# EAGLE design electricalily (EAGLE 5.11)
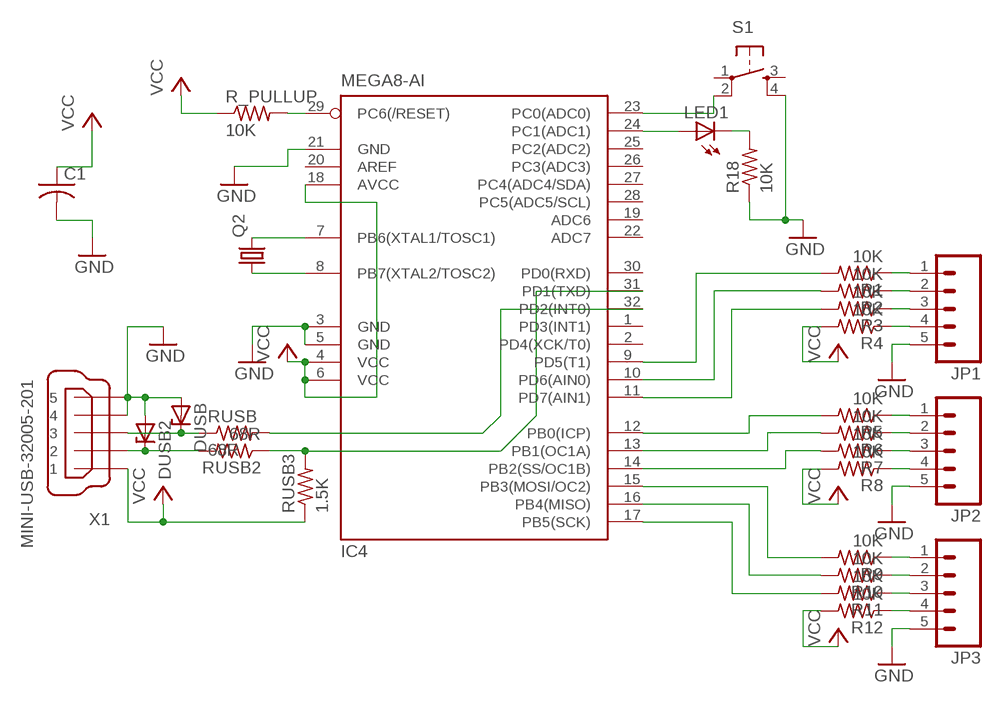
[diagram p0: schematic, sheet 1]

## Parts
C1  C-USC1206K  [C1206K]
DUSB  ZENER-DIODESOD80C  [SOD80C]
DUSB2  ZENER-DIODESOD80C  [SOD80C]
IC4  MEGA8-AI  [TQFP32-08]
JP1  M05LOCK  [1X05_LOCK]
JP2  M05LOCK  [1X05_LOCK]
JP3  M05LOCK  [1X05_LOCK]
LED1  LEDCHIPLED_1206  [CHIPLED_1206]
Q2  CRYSTAL5X3  [CRYSTAL-SMD-5X3]
R1  10K  R-US_M1206  [M1206]
R2  10K  R-US_M1206  [M1206]
R3  10K  R-US_M1206  [M1206]
R4  10K  R-US_M1206  [M1206]
R5  10K  R-US_M1206  [M1206]
R6  10K  R-US_M1206  [M1206]
R7  10K  R-US_M1206  [M1206]
R8  10K  R-US_M1206  [M1206]
R9  10K  R-US_M1206  [M1206]
R10  10K  R-US_M1206  [M1206]
R11  10K  R-US_M1206  [M1206]
R12  10K  R-US_M1206  [M1206]
R18  10K  R-US_M1206  [M1206]
R_PULLUP  10K  R-US_M1206  [M1206]
RUSB  68R  R-US_M1206  [M1206]
RUSB2  68R  R-US_M1206  [M1206]
RUSB3  1.5K  R-US_M1206  [M1206]
S1  6MM_SWITCH6MM_SWITCH  [6MM_SWITCH]
X1  MINI-USB-32005-201  [32005-201]

## Nets
GND: C1.2 DUSB2.A DUSB.A IC4.3(GND) IC4.5(GND) IC4.21(GND) JP1.5 JP2.5 JP3.5 R18.1 S1.4(S1) X1.4 X1.5
N$1: IC4.7(PB6(XTAL1/TOSC1)) Q2.3
N$2: IC4.8(PB7(XTAL2/TOSC2)) Q2.1
N$3: IC4.24(PC1(ADC1)) LED1.A
N$4: IC4.29(PC6(/RESET)) R_PULLUP.2
N$5: IC4.23(PC0(ADC0)) S1.2(P1)
N$6: LED1.C R18.2
N$7: JP1.1 R1.1
N$8: JP1.2 R2.1
N$9: JP1.3 R3.1
N$10: JP1.4 R4.1
N$11: JP2.1 R5.1
N$12: JP2.2 R6.1
N$13: JP2.3 R7.1
N$14: JP2.4 R8.1
N$15: JP3.1 R9.1
N$16: JP3.2 R10.1
N$17: JP3.3 R11.1
N$18: JP3.4 R12.1
N$20: IC4.9(PD5(T1)) R1.2
N$21: IC4.10(PD6(AIN0)) R2.2
N$22: IC4.11(PD7(AIN1)) R3.2
N$23: IC4.12(PB0(ICP)) R5.2
N$24: IC4.13(PB1(OC1A)) R6.2
N$25: IC4.14(PB2(SS/OC1B)) R7.2
N$26: IC4.15(PB3(MOSI/OC2)) R9.2
N$27: IC4.31(PD1(TXD)) RUSB2.1 RUSB3.2
N$28: DUSB2.C RUSB2.2 X1.2
N$29: IC4.16(PB4(MISO)) R10.2
N$30: IC4.17(PB5(SCK)) R11.2
N$32: DUSB.C RUSB.1 X1.3
N$33: IC4.32(PD2(INT0)) RUSB.2
VCC: C1.1 IC4.4(VCC) IC4.6(VCC) IC4.18(AVCC) R4.2 R8.2 R12.2 R_PULLUP.1 RUSB3.1 X1.1
Unconnected: IC4.1(PD3(INT1)) IC4.2(PD4(XCK/T0)) IC4.19(ADC6) IC4.20(AREF) IC4.22(ADC7) IC4.25(PC2(ADC2)) IC4.26(PC3(ADC3)) IC4.27(PC4(ADC4/SDA)) IC4.28(PC5(ADC5/SCL)) IC4.30(PD0(RXD)) S1.1(P) S1.3(S)

## Library data of the parts
C1 = rcl:C-US: CAPACITOR, American symbol
DUSB DUSB2 = diode:ZENER-DIODE: Z-Diode
IC4 = atmel:MEGA8: MICROCONTROLLER 8 Kbytes FLASH, 1 kbytes SRAM, 512 bytes EEPROM, USART, 6-channel 10 bit ADC, 2-channel 8 bit ADC Pin compatible with Atmega48, ATMega88, ATMega168 Source: avr.lbr
JP1-JP3 = SparkFun:M05: Header 5 Standard 5-pin 0.1" header. Use with straight break away headers (SKU : PRT-00116), right angle break away headers (PRT-00553), swiss pins (PRT-00743), machine pins (PRT-00117), and female headers (PRT-00115). Molex polarized connector foot print use with SKU : PRT-08230 with associated crimp pins and housings.
LED1 = led:LED: LED OSRAM: - CHIPLED LG R971, LG N971, LY N971, LG Q971, LY Q971, LO R971, LY R971 LH N974, LH R974 LS Q976, LO Q976, LY Q976 LO Q996 - Hyper CHIPLED LW Q18S LB Q993, LB Q99A, LB R99A - SideLED LS A670, LO A670, LY A670, LG A670, LP A670 LB A673, LV A673, LT A673, LW A673 LH A674 LY A675 LS A676, LA A676, LO A676, LY A676, LW A676 LS A679, LY A679, LG A679 - Hyper Micro SIDELED® LS Y876, LA Y876, LO Y876, LY Y876 LT Y87S - SmartLED LW L88C, LW L88S LB L89C, LB L89S, LG L890 LS L89K, LO L89K, LY L89K LS L896, LA L896, LO L896, LY L896 - TOPLED LS T670, LO T670, LY T670, LG T670, LP T670 LSG T670, LSP T670, LSY T670, LOP T670, LYG T670 LG T671, LOG T671, LSG T671 LB T673, LV T673, LT T673, LW T673 LH T674 LS T676, LA T676, LO T676, LY T676, LB T676, LH T676, LSB T676, LW T676 LB T67C, LV T67C, LT T67C, LS T67K, LO T67K, LY T67K, LW E67C LS E67B, LA E67B, LO E67B, LY E67B, LB E67C, LV E67C, LT E67C LW T67C LS T679, LY T679, LG T679 LS T770, LO T770, LY T770, LG T770, LP T770 LB T773, LV T773, LT T773, LW T773 LH T774 LS E675, LA E675, LY E675, LS T675 LS T776, LA T776, LO T776, LY T776, LB T776 LHGB T686 LT T68C, LB T68C - Hyper Mini TOPLED® LB M676 - Mini TOPLED Santana® LG M470 LS M47K, LO M47K, LY M47K Source: http://www.osram.convergy.de LUXEON: - LUMILED® LXK2-PW12-R00, LXK2-PW12-S00, LXK2-PW14-U00, LXK2-PW14-V00 LXK2-PM12-R00, LXK2-PM12-S00, LXK2-PM14-U00 LXK2-PE12-Q00, LXK2-PE12-R00, LXK2-PE12-S00, LXK2-PE14-T00, LXK2-PE14-U00 LXK2-PB12-K00, LXK2-PB12-L00, LXK2-PB12-M00, LXK2-PB14-N00, LXK2-PB14-P00, LXK2-PB14-Q00 LXK2-PR12-L00, LXK2-PR12-M00, LXK2-PR14-Q00, LXK2-PR14-R00 LXK2-PD12-Q00, LXK2-PD12-R00, LXK2-PD12-S00 LXK2-PH12-R00, LXK2-PH12-S00 LXK2-PL12-P00, LXK2-PL12-Q00, LXK2-PL12-R00 Source: www.luxeon.com KINGBRIGHT: KA-3528ASYC Source: www.kingbright.com
Q2 = SparkFun:CRYSTAL: Crystals Various standard crystals. Proven footprints. Spark Fun Electronics SKU : COM-00534
R1-R12 R18 R_PULLUP RUSB RUSB2 RUSB3 = resistor:R-US_: RESISTOR, American symbol
S1 = ng:6MM_SWITCH: OMRON SWITCH
X1 = con-cypressindustries:MINI-USB-: MINI USB-B Conector Source: www.cypressindustries.com

## Board
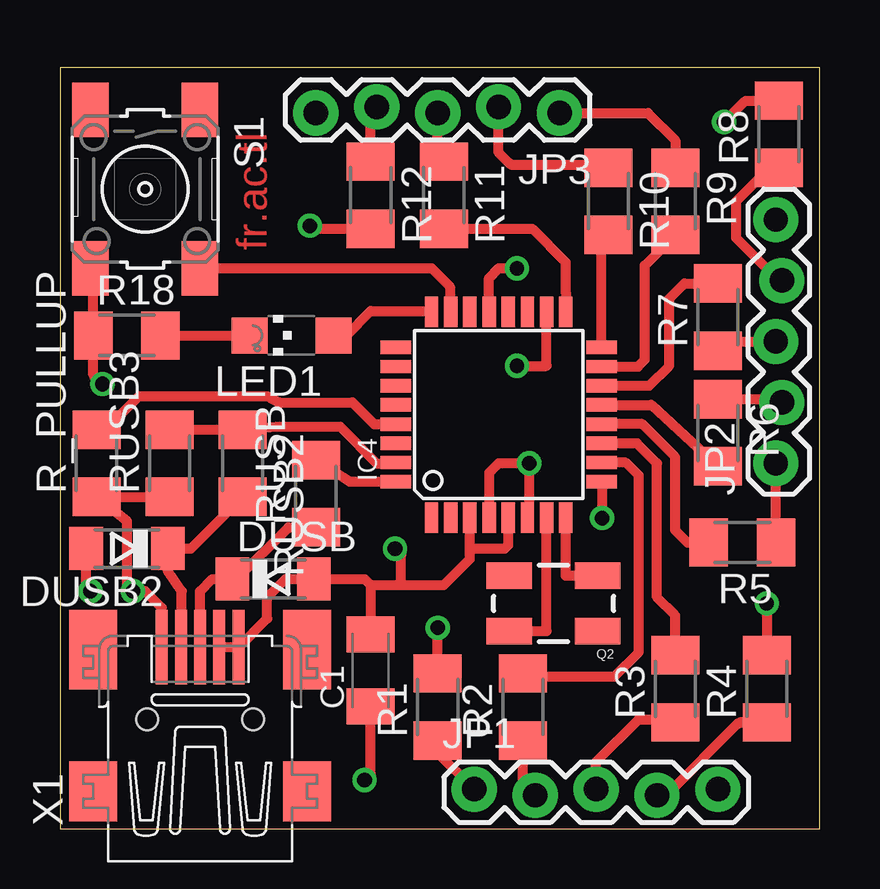
[diagram p1: board, top side]
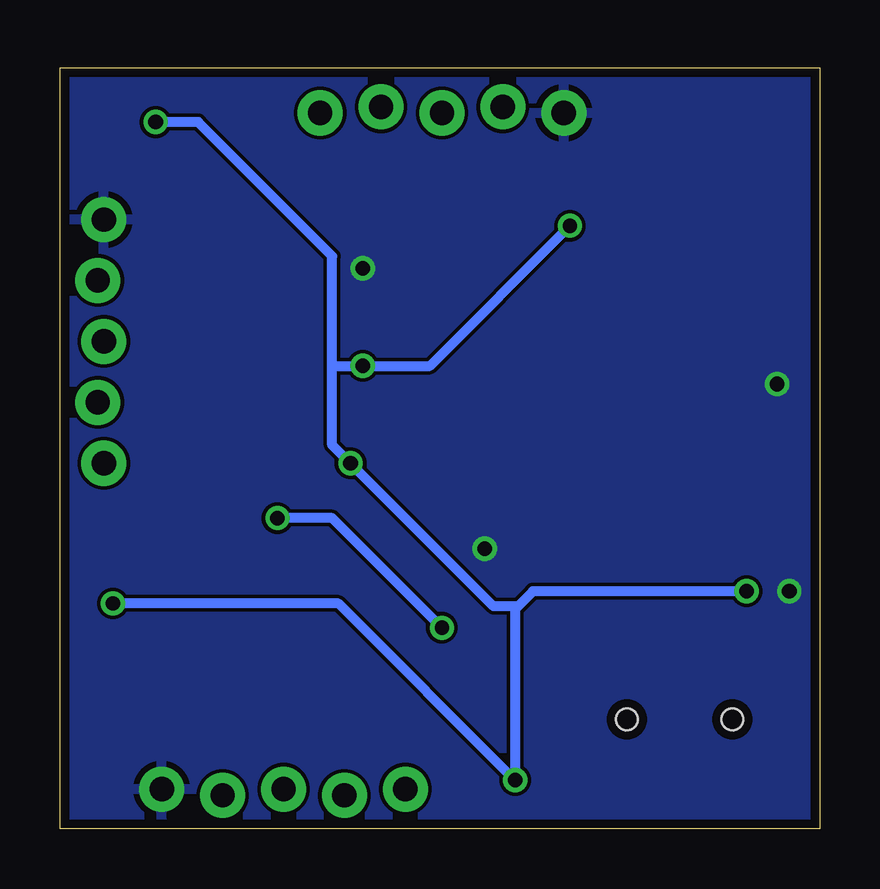
[diagram p2: board, bottom side, seen from below]

Size 31.67 x 31.74 mm. Coordinates in mm from the lower left corner, seen from the top.
Outline: 0,0 31.67,0 31.67,31.74 0,31.74 0,0
Copper layers (1*16): Top 0.0356mm / dielectric 1.5011mm / Bottom 0.0356mm
Design rules "typical_4pcb": minimum track width 10mil, minimum drill 15mil, track to track 6mil, track to pad 6mil, pad to pad 6mil, via to via 6mil, smd to smd 6mil, copper to edge 15mil, drill to drill 8mil, minimum pad ring 10mil, minimum via ring 8mil, stop-mask expansion 4mil, vias tented up to drill 0mil, thermal gap 10mil

### Footprints (pad centres in the part's own frame; a part is rotated, then mirrored left to right if it is on the bottom)
C1206K = smd 1.5 x 2: 1 -1.5,0; 2 1.5,0
SOD80C = smd 1.4 x 1.8: A 1.7,0; C -1.7,0
TQFP32-08 = smd 1.27 x 0.559: 1 -4.293,2.8; 2 -4.293,2; 3 -4.293,1.2; 4 -4.293,0.4; 5 -4.293,-0.4; 6 -4.293,-1.2; 7 -4.293,-2; 8 -4.293,-2.8; 17 4.293,-2.8; 18 4.293,-2; 19 4.293,-1.2; 20 4.293,-0.4; 21 4.293,0.4; 22 4.293,1.2; 23 4.293,2; 24 4.293,2.8 | smd 0.559 x 1.27: 9 -2.8,-4.293; 10 -2,-4.293; 11 -1.2,-4.293; 12 -0.4,-4.293; 13 0.4,-4.293; 14 1.2,-4.293; 15 2,-4.293; 16 2.8,-4.293; 25 2.8,4.293; 26 2,4.293; 27 1.2,4.293; 28 0.4,4.293; 29 -0.4,4.293; 30 -1.2,4.293; 31 -2,4.293; 32 -2.8,4.293
1X05_LOCK = drill 1.016 pad 1.88 round: 1 0,0.127; 2 2.54,-0.127; 3 5.08,0.127; 4 7.62,-0.127; 5 10.16,0.127
CHIPLED_1206 = smd 1.5 x 1.5: A 0,-1.75; C 0,1.75
CRYSTAL-SMD-5X3 = smd 1.9 x 1.1: 1 -1.85,-1.15; 2 1.85,-1.15; 3 1.85,1.15; 4 -1.85,1.15
M1206 = smd 1.6 x 2: 1 -1.4,0; 2 1.4,0
6MM_SWITCH = smd 2.286 x 1.524: 1 -3.302,2.286; 2 3.302,2.286; 3 -3.302,-2.286; 4 3.302,-2.286
32005-201 = smd 3.1 x 0.5: 1 3,1.6; 2 3,0.8; 3 3,0; 4 3,-0.8; 5 3,-1.6 | smd 2.5 x 2: M1 -3,-4.45; M2 -3,4.45 | smd 3.3 x 2: M3 2.9,4.45; M4 2.9,-4.45 | hole 0.9: 0,2.2; 0,-2.2

### Placement (x,y rotation side)
C1  12.95,6.6 90 top
DUSB  8.89,10.41 0 top
DUSB2  2.79,11.68 180 top
IC4  18.29,17.27 90 top
JP1  17.27,1.52 0 top
JP2  29.97,15.24 90 top
JP3  20.83,29.97 180 top
LED1  9.65,20.57 90 top
Q2  20.57,9.4 180 top
R1  15.75,5.08 90 top
R2  19.3,5.08 90 top
R3  25.65,5.84 90 top
R4  29.46,5.84 90 top
R5  28.45,11.94 180 top
R6  27.43,16.51 270 top
R7  27.43,21.34 90 top
R8  29.97,28.96 90 top
R9  25.65,26.16 270 top
R10  22.86,26.16 270 top
R11  16,26.42 270 top
R12  12.95,26.42 270 top
R18  2.79,20.57 0 top
R_PULLUP  1.52,15.24 90 top
RUSB  10.67,13.97 90 top
RUSB2  7.62,15.24 270 top
RUSB3  4.57,15.24 90 top
S1  3.56,26.67 270 top
X1  5.84,4.57 90 top

### Tracks (layer width: path | path; a pad name or v marks a point on that pad's centre or on a via)
GND  (via drill 0.6, 0.61)
  Top 0.406: 17.09,11.68 17.09,11.25 16,10.16 14.22,10.16 | 17.09,11.68 IC4.3 | 12.95,10.16 14.22,10.16 | IC4.5 18.69,11.83 18.54,11.68 17.09,11.68 | 12.95,10.16 C1.2 | v13.97,11.68 14.22,11.43 14.22,10.16 | v1.78,18.54 1.39,18.93 R18.1 1.39,23.5 S1.4 | 12.95,10.16 12.7,10.41 DUSB.A 9.4,10.41 8.64,9.65 8.64,8.77 X1.5 X1.4 | v19.05,23.37 18.29,23.37 17.89,22.97 IC4.21 | DUSB2.A 1.09,10.08 v1.27,9.91
  pour Bottom: 0,31.24 31.24,31.24 31.24,0.25 0,0.25
N$1
  Top 0.406: IC4.7 20.29,8.25 Q2.3
N$2
  Top 0.406: IC4.8 21.09,10.55 Q2.1
N$3
  Top 0.406: LED1.A 11.94,20.57 12.95,21.59 15.46,21.59 IC4.24
N$4
  Top 0.406: R_PULLUP.2 1.91,16.64 3.3,18.03 8.64,18.03 9.14,17.78 12.19,17.78 13.1,16.87 IC4.29
N$5
  Top 0.406: IC4.23 16.26,21.6 16.26,22.61 15.49,23.37 S1.2
N$6
  Top 0.406: R18.2 LED1.C
N$7
  Top 0.406: JP1.1 15.75,3.17 R1.1
N$8
  Top 0.406: JP1.2 19.3,1.91 R2.1
N$9
  Top 0.406: JP1.3 22.35,2.79 24.13,4.57 25.52,4.57 R3.1
N$10
  Top 0.406: JP1.4 25.17,1.4 arc45 25.35,1.47 28.24,4.37 arc-45 28.42,4.44 R4.1
N$11
  Top 0.406: JP2.1 R5.1
N$12
  Top 0.406: R6.1 29.97,17.91 JP2.2
N$13
  Top 0.406: JP2.3 27.82,20.32 R7.1
N$14
  Top 0.406: JP2.4 29.97,22.86 28.19,24.64 28.19,26.16 29.46,27.43 29.85,27.43 R8.1
N$15
  Top 0.406: R9.1 25.65,28.7 24.51,29.84 JP3.1
N$16
  Top 0.406: R10.1 22.74,27.69 18.9,27.69 arc-45 18.72,27.76 18.29,28.19 JP3.2
N$17
  Top 0.406: 15.75,27.82 R11.1 15.75,28.07 JP3.3
N$18
  Top 0.406: R12.1 12.95,29.84 JP3.4
N$20  (via drill 0.6)
  Top 0.406: IC4.9 22.61,14.45 v22.61,12.95 | R1.2 v15.75,8.38
  Bottom 0.406: v15.75,8.38 20.32,12.95 v22.61,12.95
N$21
  Top 0.406: IC4.10 23.59,15.27 24.13,14.73 24.13,7.37 23.11,6.35 19.43,6.35 R2.2
N$22
  Top 0.406: IC4.11 24.06,16.07 24.89,15.24 24.89,9.65 25.65,8.89 R3.2
N$23
  Top 0.406: IC4.12 24.28,16.87 25.65,15.49 25.65,12.45 26.16,11.94 R5.2
N$24
  Top 0.406: IC4.13 24.65,17.67 R6.2
N$25
  Top 0.406: IC4.14 24.57,18.47 25.4,19.3 25.4,22.1 26.04,22.74 R7.2
N$26
  Top 0.406: IC4.15 24.1,19.27 24.38,19.56 24.38,23.49 R9.2
N$27
  Top 0.254: RUSB3.2 5.08,17.02 | RUSB2.1 7.62,17.02
  Top 0.406: IC4.31 13.96,15.24 13.21,15.24 11.68,16.76 9.01,16.76 RUSB2.1 5.46,16.64 5.08,17.02
N$28
  Top 0.406: DUSB2.C 4.32,11.35 | DUSB2.C 5.46,11.68 RUSB2.2 | X1.2 5.08,7.61 5.08,9.91 4.49,10.75 DUSB2.C
N$29
  Top 0.406: IC4.16 22.58,24.48 R10.2
N$30
  Top 0.406: IC4.17 21.09,22.36 21.08,22.36 21.08,23.62 19.69,25.02 R11.2
N$32
  Top 0.406: DUSB.C 7.19,11 | RUSB.1 9.52,12.57 7.37,10.41 DUSB.C | X1.3 5.84,9.91 6.35,10.41 DUSB.C
N$33
  Top 0.406: IC4.32 12.07,14.47 RUSB.2
VCC  (via drill 0.6, 0.61)
  Top 0.254: IC4.6 19.56,12.7
  Top 0.406: R_PULLUP.1 2.03,13.33 | R_PULLUP.1 RUSB3.1 | IC4.4 17.89,14.84 18.29,15.24 v19.56,15.24 19.56,13.05 IC4.6 | R_PULLUP.1 2.79,12.82 2.79,10.16 v3.05,9.91 3.56,9.91 4.24,9.22 X1.1 | v29.46,9.4 R4.2 | R12.2 10.54,25.02 v10.41,25.15 | IC4.18 20.29,19.3 v19.05,19.3 | v12.7,2.03 12.95,2.29 C1.1 | R8.2 28.58,30.36 v27.69,29.46
  Bottom 0.406: v3.05,9.91 11.96,9.91 12.59,9.28 | 12.59,9.28 12.7,9.17 v12.7,2.03 20.07,9.4 v29.46,9.4 | 12.59,9.28 13.6,9.28 v19.56,15.24 20.32,16 20.32,19.3 | 20.32,19.3 20.32,23.88 25.91,29.46 v27.69,29.46 | v10.41,25.15 16.26,19.3 v19.05,19.3 20.32,19.3

### Text on the board
Top: fr.ac.tl